# EAGLE design buckconvertervrs (EAGLE 6.6.0)
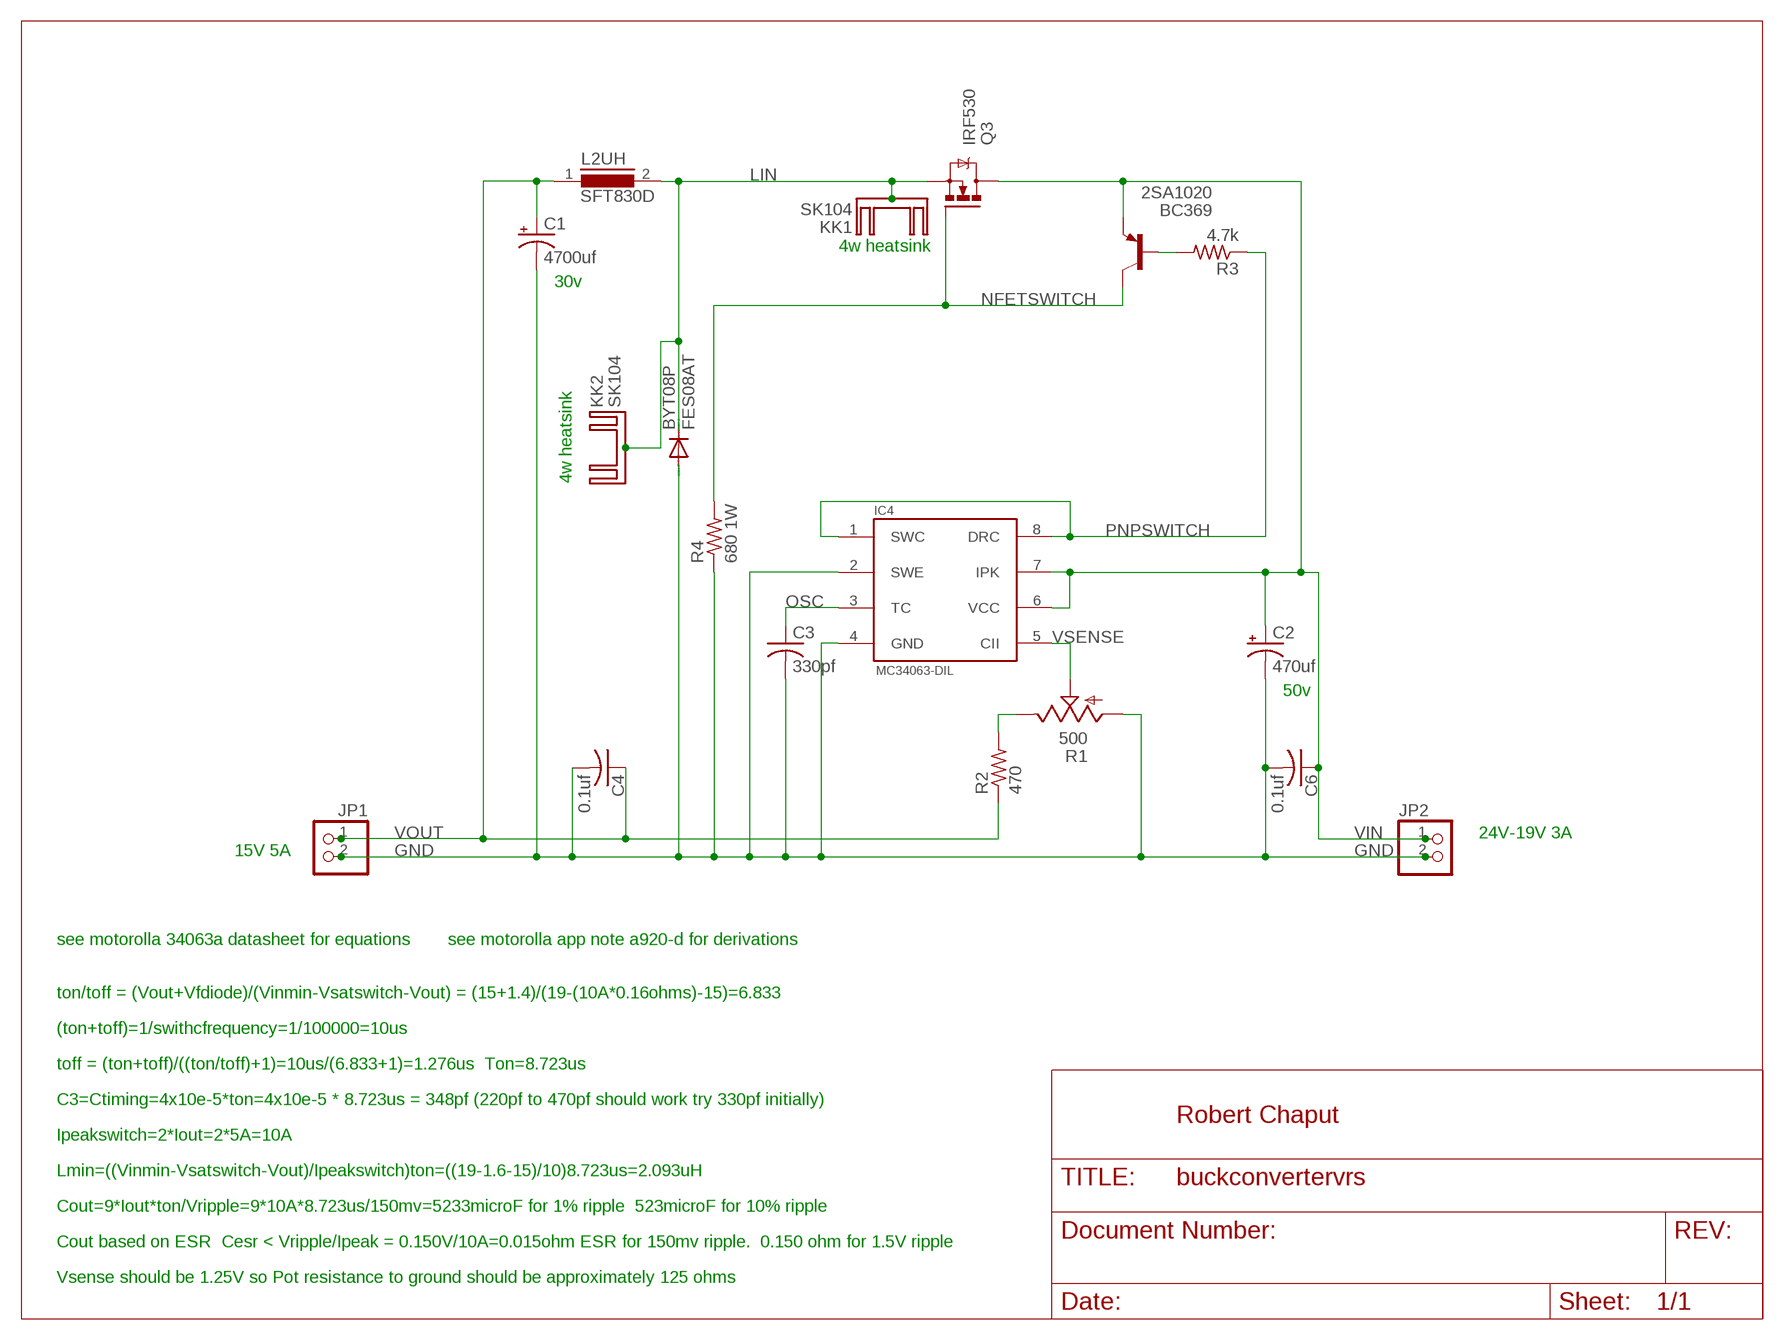
[diagram p0: schematic, sheet 1]

## Parts
2SA1020  BC369  [TO92-BCE]
BYT08P  FES08AT  [DO220S]
C1  4700uf  CPOL-USE10-30  [EB30D]
C2  470uf  CPOL-USE5-8.5  [E5-8,5]
C3  330pf  C-US050-030X075  [C050-030X075]
C4  0.1uf  C-US050-030X075  [C050-030X075]
C6  0.1uf  C-US050-030X075  [C050-030X075]
IC4  MC34063-DIL  [DIL08]
JP1  PINHD-1X2  [1X02]
JP2  PINHD-1X2  [1X02]
KK1  SK104  [SK104]
KK2  SK104  [SK104]
L2UH  SFT830D  [SFT830D]
Q3  IRF530  [TO220BV]
R1  500  TRIM_US-PTSPIN  [PT-SPIN]
R2  470  R-US_0309/V  [0309V]
R3  4.7k  R-US_0309/V  [0309V]
R4  680 1W  R-US_0613/5V  [P0613V]

## Nets
GND: BYT08P.A C1.- C2.- C3.2 C4.2 C6.2 IC4.2(SWE) IC4.4(GND) JP1.2 JP2.2 R1.A R4.1
LIN: BYT08P.C L2UH.2 Q3.S
N$1: R1.E R2.2
N$8: 2SA1020.B R3.2
NFETSWITCH: 2SA1020.C Q3.G R4.2
OSC: C3.1 IC4.3(TC)
PNPSWITCH: IC4.1(SWC) IC4.8(DRC) R3.1
VIN: 2SA1020.E C2.+ C6.1 IC4.6(VCC) IC4.7(IPK) JP2.1 Q3.D
VOUT: C1.+ C4.1 JP1.1 L2UH.1 R2.1
VSENSE: IC4.5(CII) R1.S

## Notes on the sheet
- 4w heatsink
- 30v
- 4w heatsink
- 50v
- 24V-19V 3A
- 15V 5A
- see motorolla 34063a datasheet for equations | see motorolla app note a920-d for derivations
- ton/toff = (Vout+Vfdiode)/(Vinmin-Vsatswitch-Vout) = (15+1.4)/(19-(10A*0.16ohms)-15)=6.833
- (ton+toff)=1/swithcfrequency=1/100000=10us
- toff = (ton+toff)/((ton/toff)+1)=10us/(6.833+1)=1.276us  Ton=8.723us
- C3=Ctiming=4x10e-5*ton=4x10e-5 * 8.723us = 348pf (220pf to 470pf should work try 330pf initially)
- Robert Chaput
- Ipeakswitch=2*Iout=2*5A=10A
- Lmin=((Vinmin-Vsatswitch-Vout)/Ipeakswitch)ton=((19-1.6-15)/10)8.723us=2.093uH
- Cout=9*Iout*ton/Vripple=9*10A*8.723us/150mv=5233microF for 1% ripple  523microF for 10% ripple
- Cout based on ESR  Cesr < Vripple/Ipeak = 0.150V/10A=0.015ohm ESR for 150mv ripple.  0.150 ohm for 1.5V ripple
- Vsense should be 1.25V so Pot resistance to ground should be approximately 125 ohms

## Library data of the parts
2SA1020 = transistor-pnp:BC369*: PNP Transistror
BYT08P = diode:FES08AT: DIODE ultra-fast recovery rectifier
C1 C2 = rcl:CPOL-US: POLARIZED CAPACITOR, American symbol
C3 C4 C6 = rcl:C-US: CAPACITOR, American symbol
IC4 = mc34063:MC34063-DIL: DC/DC converter MC34063 in DIL08.
JP1 JP2 = pinhead:PINHD-1X2: PIN HEADER
KK1 KK2 = heatsink:SK104: HEATSINK manufacturer Fischer/distributor Buerklin
L2UH = inductors:SFT830D: INDUCTOR
Q3 = transistor-power:IRF530: HEXFET Power MOSFET
R1 = pot:TRIM_US-: POTENTIOMETER
R2-R4 = rcl:R-US_: RESISTOR, American symbol

## Net classes
0 default: width 1.27 mm

## Board
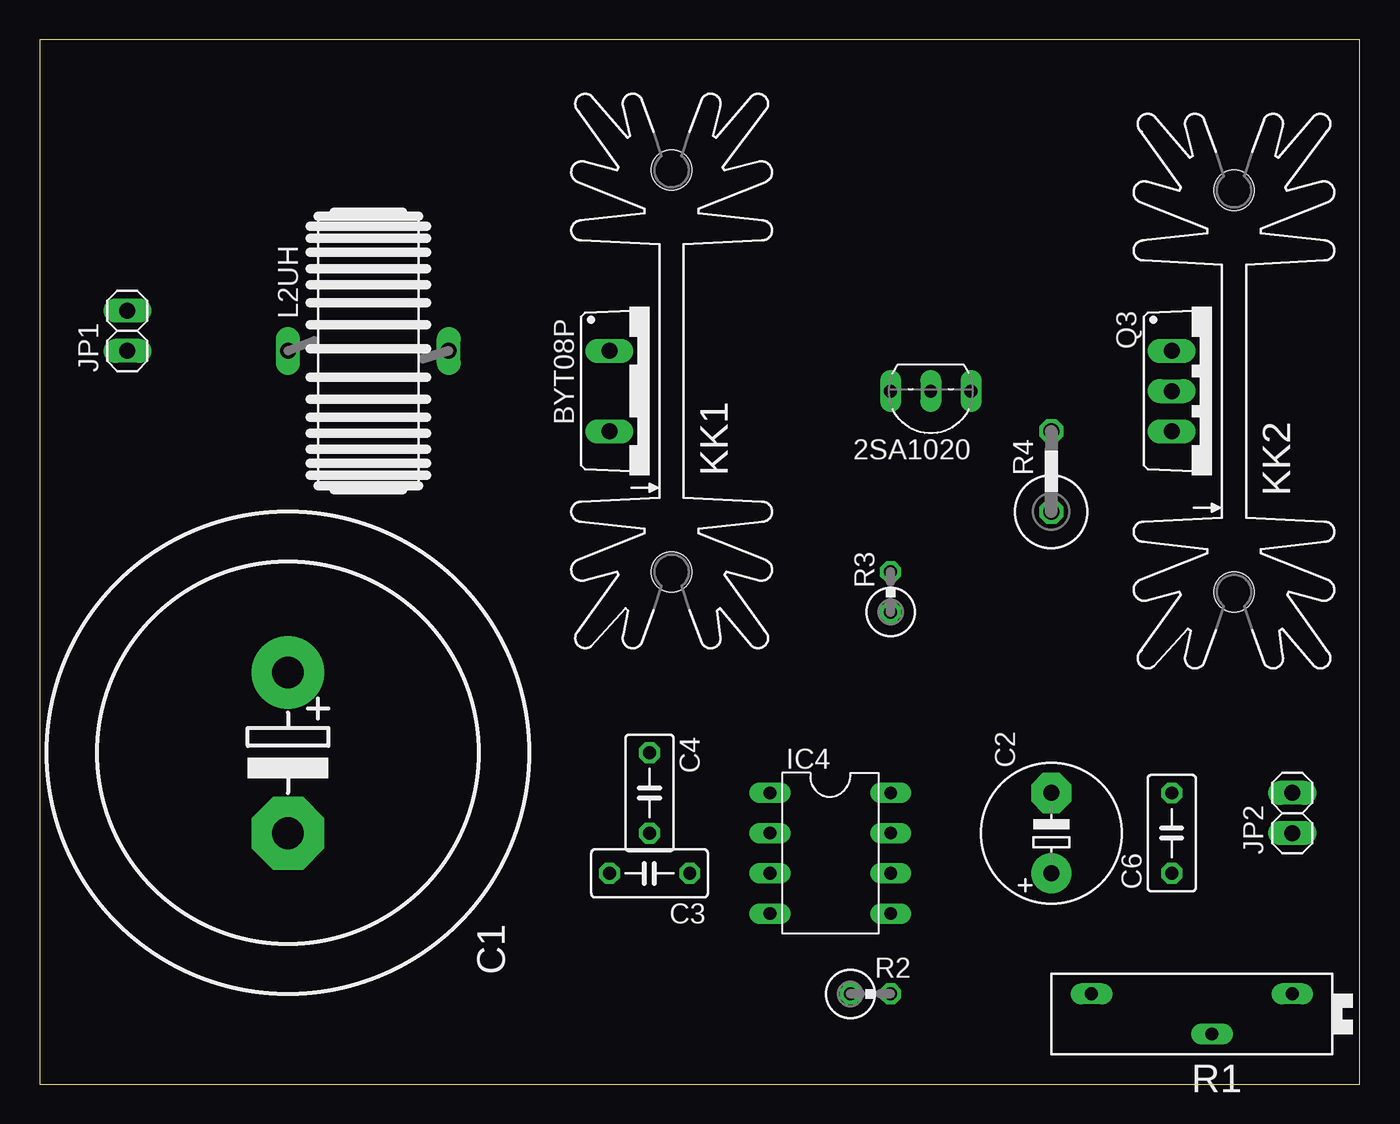
[diagram p1: board, top side]
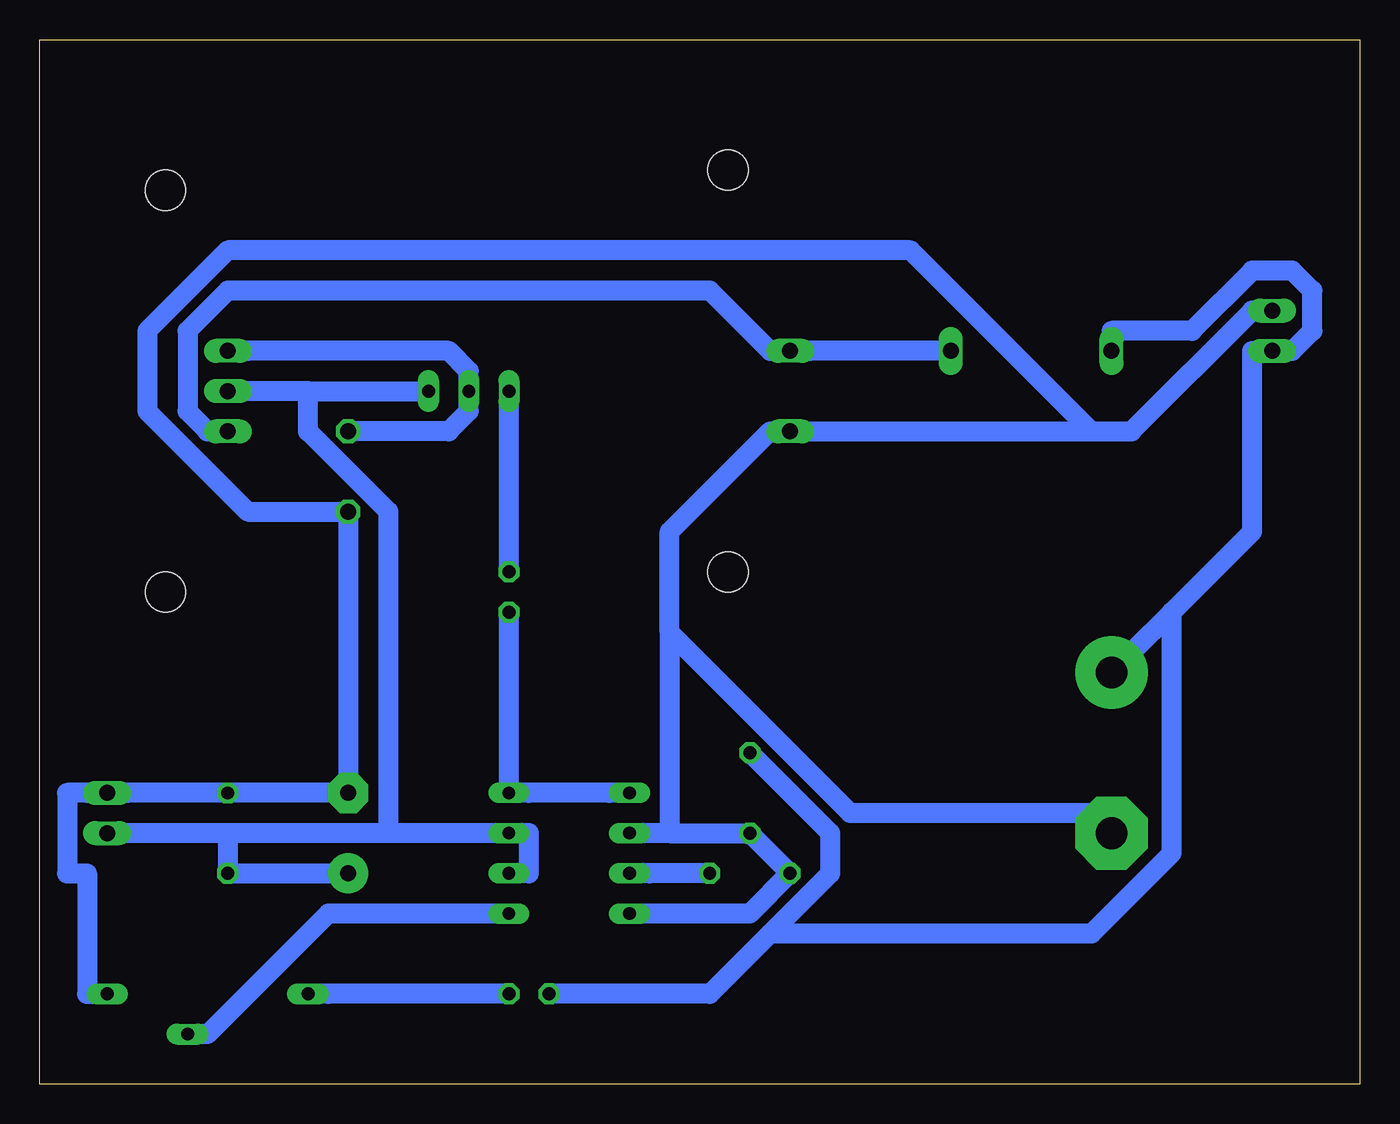
[diagram p2: board, bottom side, seen from below]

Size 83.49 x 66.03 mm. Coordinates in mm from the lower left corner, seen from the top.
Outline: 0,0 83.49,0 83.49,66.03 0,66.03 0,0
Copper layers (1*16): Top 0.035mm / dielectric 1.5mm / Bottom 0.035mm
Design rules "15mils": minimum track width 15mil, minimum drill 24mil, track to track 15mil, track to pad 10mil, pad to pad 10mil, via to via 10mil, smd to smd 10mil, copper to edge 13mil, drill to drill 10mil, minimum pad ring 10mil, minimum via ring 8mil, stop-mask expansion 0mil, vias tented up to drill 0mil, thermal gap 10mil

### Footprints (pad centres in the part's own frame; a part is rotated, then mirrored left to right if it is on the bottom)
TO92-BCE = drill 0.813 long: B 2.54,0; C 0,0; E -2.54,0
DO220S = drill 1.016 long: A 2.54,-2.54; C -2.54,-2.54
EB30D = drill 2.007 pad 4.597: + -5.08,0 | drill 2.007 pad 4.597 octagon: - 5.08,0
E5-8,5 = drill 1.016 pad 2.54: + -2.54,0 | drill 1.016 pad 2.54 octagon: - 2.54,0
C050-030X075 = drill 0.813 octagon: 1 -2.54,0; 2 2.54,0
DIL08 = drill 0.8 long: 1 -3.81,-3.81; 2 -1.27,-3.81; 3 1.27,-3.81; 4 3.81,-3.81; 5 3.81,3.81; 6 1.27,3.81; 7 -1.27,3.81; 8 -3.81,3.81
1X02 = drill 1.016 long: 1 -1.27,0; 2 1.27,0
SK104 = hole 2.54: -12.7,-0.762; 12.7,-0.762
SFT830D = drill 1.016 long: 1 -5.08,0; 2 5.08,0
TO220BV = drill 1.016 long: D 0,-2.54; G -2.54,-2.54; S 2.54,-2.54
PT-SPIN = drill 0.813 long: A -6.35,-1.27; E 6.35,-1.27; S -1.27,1.27
0309V = drill 0.813 octagon: 1 -1.27,0; 2 1.27,0
P0613V = drill 1.016 octagon: 1 -2.54,0; 2 2.54,0

### Placement (x,y rotation side)
2SA1020  56.35,43.81 180 top
BYT08P  38.57,43.81 270 top
C1  15.71,20.95 270 top
C2  63.97,15.87 90 top
C3  38.57,13.33 180 top
C4  38.57,18.41 270 top
C6  71.59,15.87 90 top
IC4  50,14.6 270 top
JP1  5.55,47.62 90 top
JP2  79.21,17.14 90 top
KK1  39.2,45.08 90 top
KK2  74.77,43.81 90 top
L2UH  20.79,46.35 0 top
Q3  74.13,43.81 270 top
R1  72.86,4.44 180 top
R2  52.54,5.71 0 top
R3  53.81,31.11 90 top
R4  63.97,38.73 90 top

### Tracks (layer width: path | path; a pad name or v marks a point on that pad's centre or on a via)
GND
  Bottom 1.27: R1.A 80.48,5.71 80.48,13.33 81.75,13.33 81.75,18.41 80.48,18.41 JP2.2 77.94,18.41 C6.2 C2.- R4.1 70.32,36.19 76.67,42.54 76.67,47.62 71.59,52.7 28.41,52.7 16.98,41.27 | IC4.4 44.92,10.79 38.57,10.79 C3.2 C4.2 43.65,15.87 | 43.65,15.87 44.92,15.87 IC4.2 | 43.65,28.57 43.65,15.87 | 43.65,28.57 43.65,34.92 37.3,41.27 BYT08P.A 34.76,41.27 16.98,41.27 | 16.98,41.27 14.44,41.27 6.82,48.89 JP1.2 | 43.65,28.57 32.22,17.14 16.98,17.14 C1.-
LIN
  Bottom 1.27: L2UH.2 34.76,46.35 BYT08P.C 37.3,46.35 41.11,50.16 71.59,50.16 74.13,47.62 74.13,42.54 72.86,41.27 Q3.S
N$1
  Bottom 1.27: R2.2 65.24,5.71 R1.E
N$8
  Bottom 1.27: R3.2 53.81,42.54 2SA1020.B
NFETSWITCH
  Bottom 1.27: R4.2 57.62,41.27 56.35,42.54 2SA1020.C 56.35,45.08 57.62,46.35 70.32,46.35 Q3.G
OSC
  Bottom 1.27: C3.1 44.92,13.33 IC4.3
PNPSWITCH
  Bottom 1.27: IC4.1 47.46,18.41 52.54,18.41 IC4.8 R3.1
VIN
  Bottom 1.27: 66.51,43.81 70.32,43.81 Q3.D | 66.51,43.81 2SA1020.E | C2.+ C6.1 71.59,15.87 | IC4.6 52.54,13.33 52.54,15.87 IC4.7 55.08,15.87 61.43,15.87 | 61.43,15.87 71.59,15.87 | 71.59,15.87 77.94,15.87 JP2.1 | 66.51,43.81 66.51,41.27 61.43,36.19 61.43,15.87
VOUT
  Bottom 1.27: R2.1 41.11,5.71 37.3,9.52 | 37.3,9.52 33.49,13.33 33.49,15.87 C4.1 | 11.9,29.84 14.44,27.3 C1.+ | 11.9,29.84 6.82,34.92 6.82,46.35 JP1.1 4.28,46.35 3.01,47.62 3.01,50.16 4.28,51.43 6.82,51.43 10.63,47.62 15.71,47.62 L2UH.1 | 37.3,9.52 16.98,9.52 11.9,14.6 11.9,29.84
VSENSE
  Bottom 1.27: IC4.5 55.08,10.79 65.24,10.79 72.86,3.17 R1.S